# Altium schematic sheet FlyOver_connector.SchDoc: FMC ADC 128CH 10B
size 420 x 297 mm; Author: G.Kasprowicz; CompanyName: WUT ISE; DrawnBy: G.Kasprowicz; Organization: WUT ISE; Address1: PW ISE; Address2: Nowowiejska 15/19 00-665 Warsaw; Address3: gkasprow@gmail.com; DocumentNumber: 9; Revision: 1; SheetNumber: 9; SheetTotal: 9; ModifiedBy: -; CheckedDate: -; Title2: FlyOver connector; DivGrp: WUT ISE; Designer: G.Kasprowicz; ModifiedDate: -; ProjectName: Sensor Box
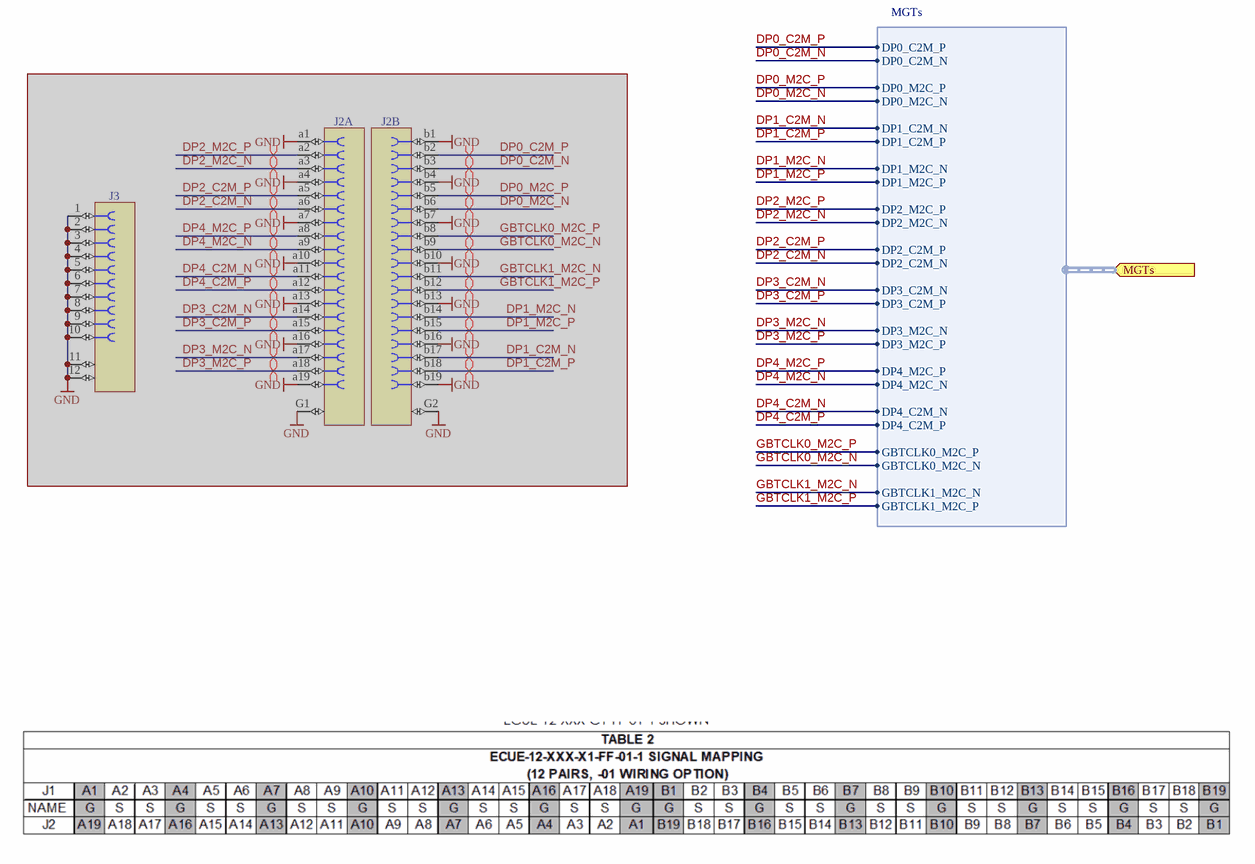
[diagram p0: FlyOver_connector.SchDoc]

## Parts
J2  Socket 38  [SAMTEC_UEC5-019-1-H-D-RA-1-A]  (value not drawn)  (parts A,B of 2)  (masked out: inside a compile mask, not in the netlist)
J3  Socket 10  [SAMTEC_UCC8-010-1-H-S-1-A]  (value not drawn)  (masked out: inside a compile mask, not in the netlist)

## Ports
MGTs (in, harness MGTs)

## Harnesses
MGTs: DP0_C2M_P, DP0_M2C_P, DP0_M2C_N, DP1_M2C_N, DP1_M2C_P, DP0_C2M_N, DP1_C2M_N, DP1_C2M_P, DP2_M2C_P, DP2_M2C_N, DP2_C2M_P, DP2_C2M_N, DP3_C2M_N, DP3_C2M_P, DP3_M2C_N, DP3_M2C_P, DP4_M2C_P, DP4_M2C_N, DP4_C2M_N, DP4_C2M_P, GBTCLK0_M2C_P, GBTCLK0_M2C_N, GBTCLK1_M2C_N, GBTCLK1_M2C_P

## Nets
DP0_C2M_N: port MGTs.DP0_C2M_N
DP0_C2M_P: port MGTs.DP0_C2M_P
DP0_M2C_N: port MGTs.DP0_M2C_N
DP0_M2C_P: port MGTs.DP0_M2C_P
DP1_C2M_N: port MGTs.DP1_C2M_N
DP1_C2M_P: port MGTs.DP1_C2M_P
DP1_M2C_N: port MGTs.DP1_M2C_N
DP1_M2C_P: port MGTs.DP1_M2C_P
DP2_C2M_N: port MGTs.DP2_C2M_N
DP2_C2M_P: port MGTs.DP2_C2M_P
DP2_M2C_N: port MGTs.DP2_M2C_N
DP2_M2C_P: port MGTs.DP2_M2C_P
DP3_C2M_N: port MGTs.DP3_C2M_N
DP3_C2M_P: port MGTs.DP3_C2M_P
DP3_M2C_N: port MGTs.DP3_M2C_N
DP3_M2C_P: port MGTs.DP3_M2C_P
DP4_C2M_N: port MGTs.DP4_C2M_N
DP4_C2M_P: port MGTs.DP4_C2M_P
DP4_M2C_N: port MGTs.DP4_M2C_N
DP4_M2C_P: port MGTs.DP4_M2C_P
GBTCLK0_M2C_N: port MGTs.GBTCLK0_M2C_N
GBTCLK0_M2C_P: port MGTs.GBTCLK0_M2C_P
GBTCLK1_M2C_N: port MGTs.GBTCLK1_M2C_N
GBTCLK1_M2C_P: port MGTs.GBTCLK1_M2C_P

## Layout directives
differential pair: (no net found under the mark)

## Notes on the sheet
- Project/Equipment
- Document
- Designer
- Drawn by
- Check.by
- Copyright WUT ISE 2018.
  This documentation describes Open Hardware and is licensed under the CERN OHL v.1.1. You may redistribute and modify this documentation under the terms of the CERN OHL v.1.1. (http://ohwr.org/CERNOHL). This documentation is distributed WITHOUT ANY EXPRESS OR IMPLIED WARRANTY, INCLUDING OF MERCHANTABILITY, SATISFACTORY QUALITY AND FITNESS FOR A PARTICULAR PURPOSE. Please see the CERN OHL v.1.1 for applicable conditions.
- Contact
- File
- Last Mod.
- Print Date
- Sheet
- Size
- A3
- of
- Rev

## Library data of the parts
J2 = SAMTEC_UEC5-019-1-H-D-RA-1-A: Connector 38ab Female (2x19) + 2x1; Part Description: 38 Contacts, Pitch 0.5mm, Rugged Micro Flyover Socket System; Manufacturer: SAMTEC; PressFit: No; Part Number: SAMTEC_UEC5-019-1-H-D-RA-1-A; Component Kind: Standard; Component Type: Standard; Pin Count: 38; Family: Socket 38; Mounted: Yes; Socket: No; SMD: Yes; Sense: No; Status: None; Manufacturer Part Number: UEC5-019-1-H-D-RA-1-A; ComponentHeight: 3.31mm; HelpURL: \\cern.ch\dfs\Applications\Altium\Datasheets\SAMTEC_UEC5-019-1-H-D-RA-1-A.pdf; Author: CERN DEM JLC; CreateDate: 09.06.2015; LatestRevisionDate: 15.06.2015
J3 = SAMTEC_UCC8-010-1-H-S-1-A: Connector 10 Female + 2; Part Description: 10 Contacts, Pitch 0.8mm, Rugged Micro Flyover Socket System; Manufacturer: SAMTEC; PressFit: No; Part Number: SAMTEC_UCC8-010-1-H-S-1-A; Component Kind: Standard; Component Type: Standard; Pin Count: 10; Family: Socket 10; Mounted: Yes; Socket: No; SMD: Yes; Sense: No; Status: None; Manufacturer Part Number: UCC8-010-1-H-S-1-A; ComponentHeight: 3.95mm; HelpURL: \\cern.ch\dfs\Applications\Altium\Datasheets\SAMTEC_UCC8-010-1-H-S-1-A.pdf; Author: CERN DEM JLC; CreateDate: 09.06.2015; LatestRevisionDate: 09.06.2015